# EAGLE design KW2CPU.PCB (EAGLE 6.6.0)
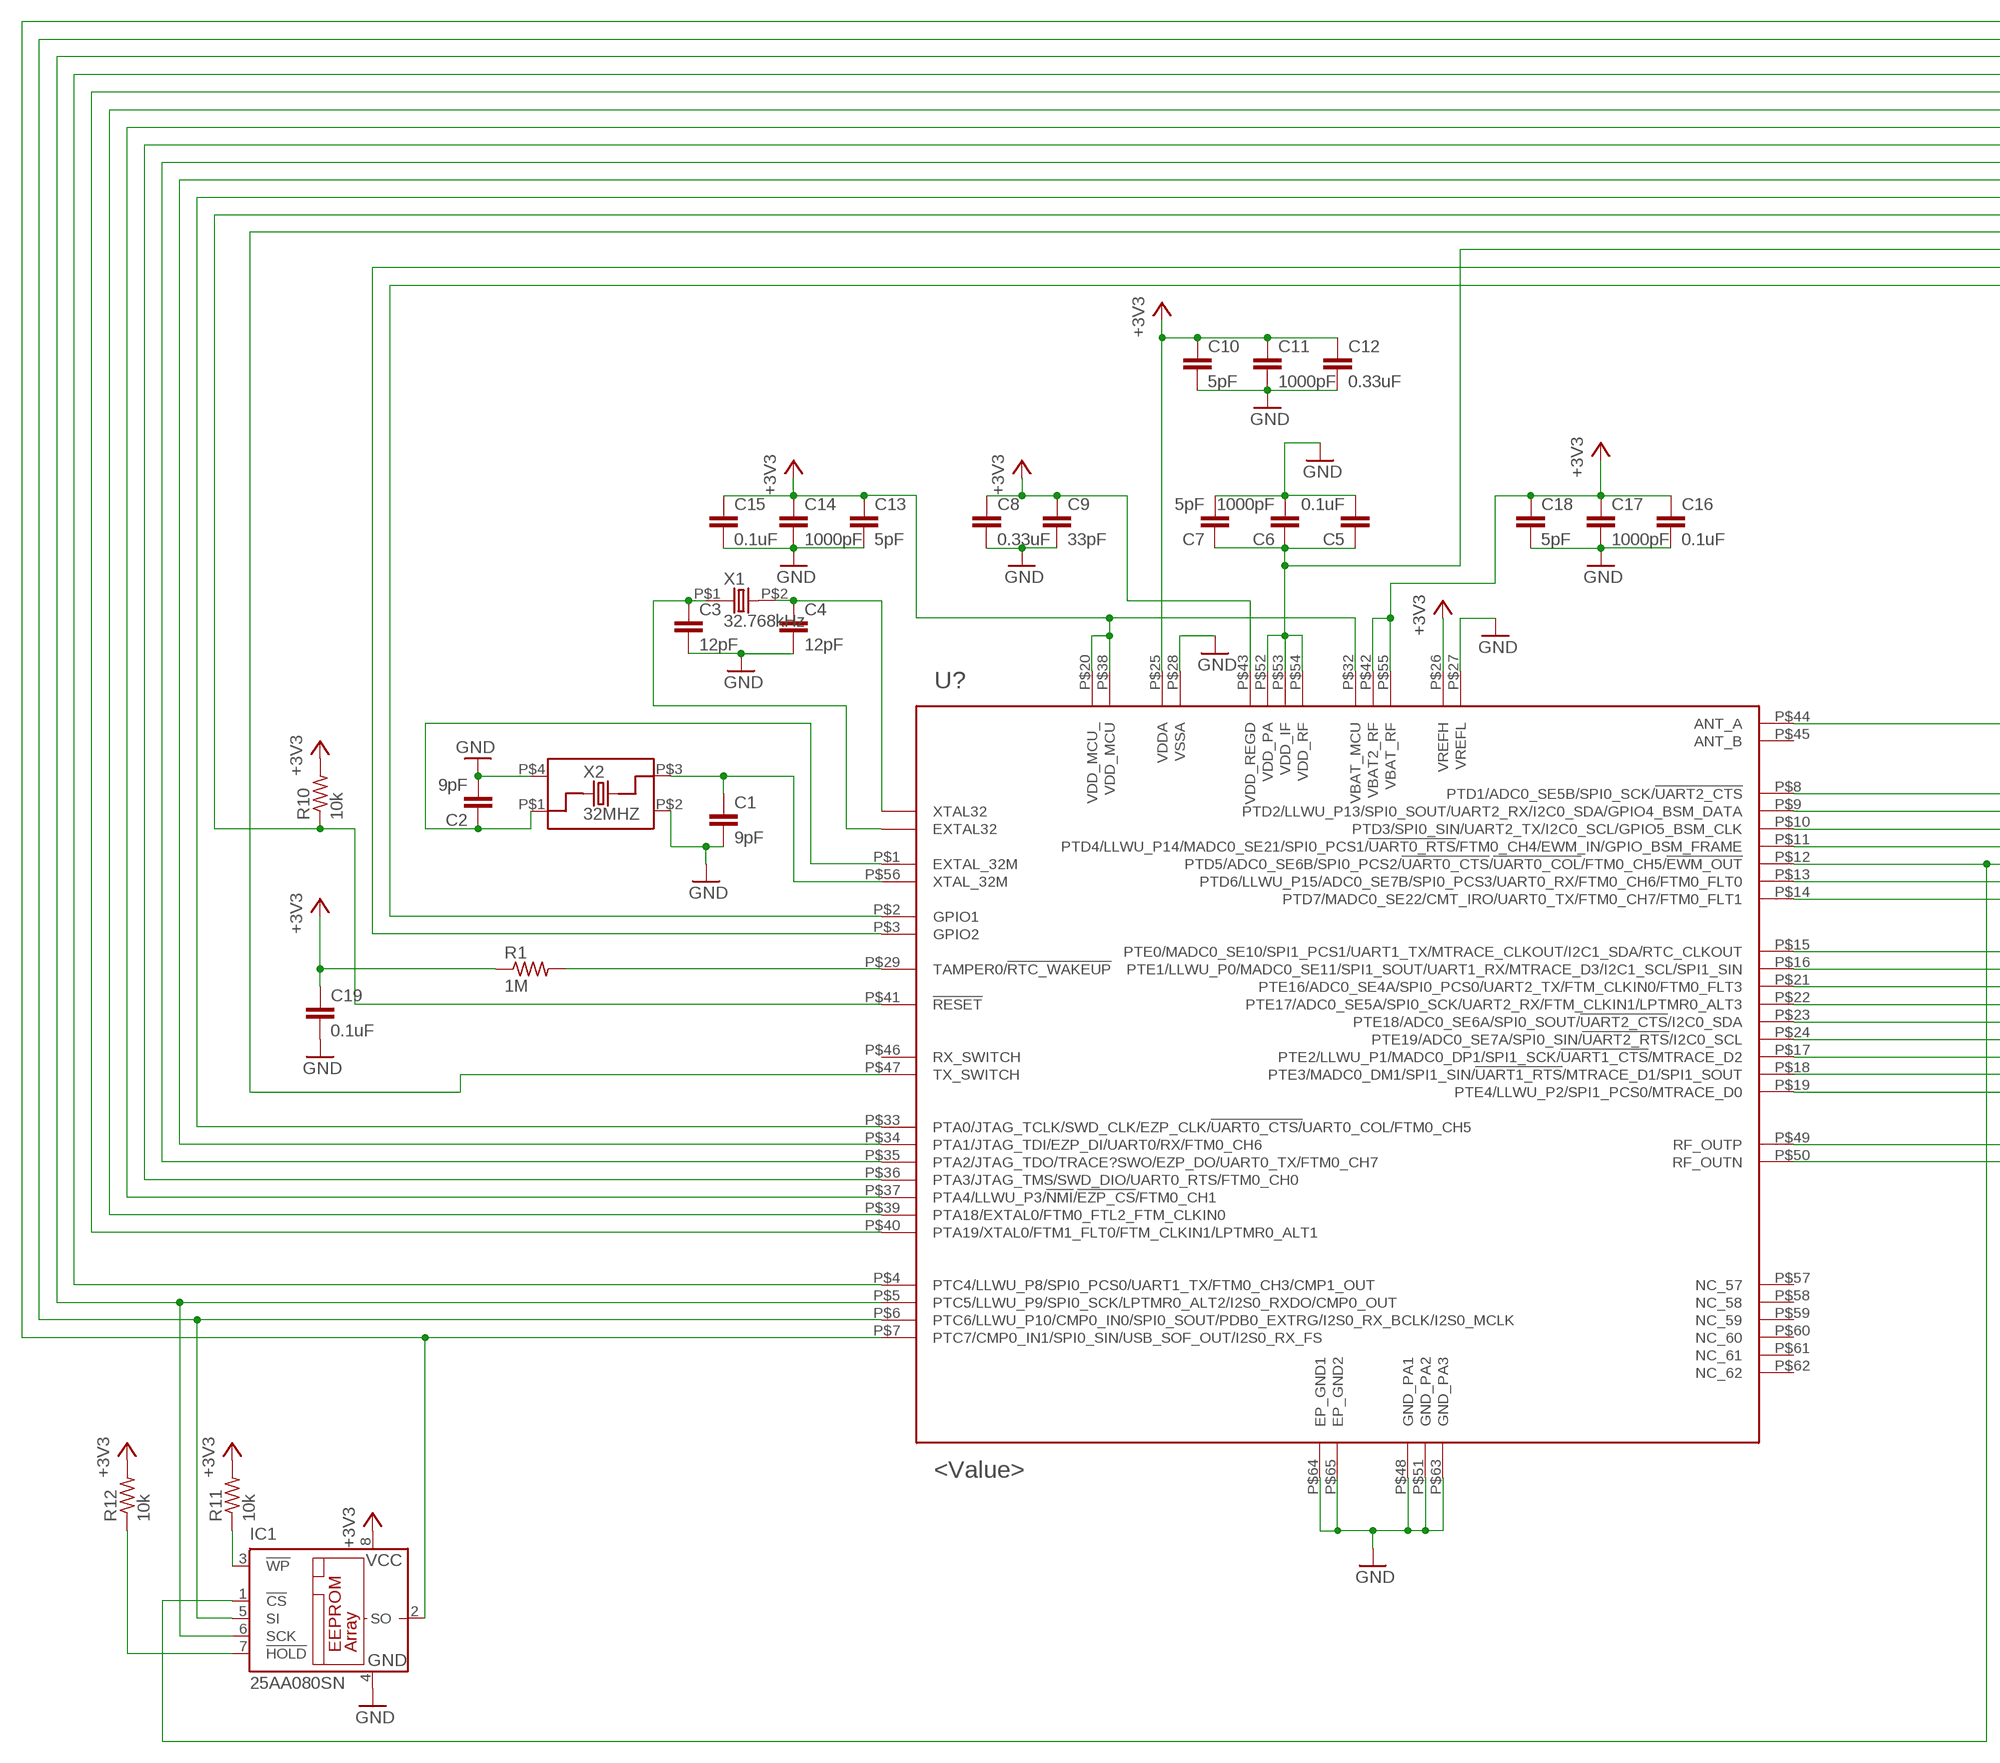
[diagram p0: schematic, sheet 1, part 1 of 2]
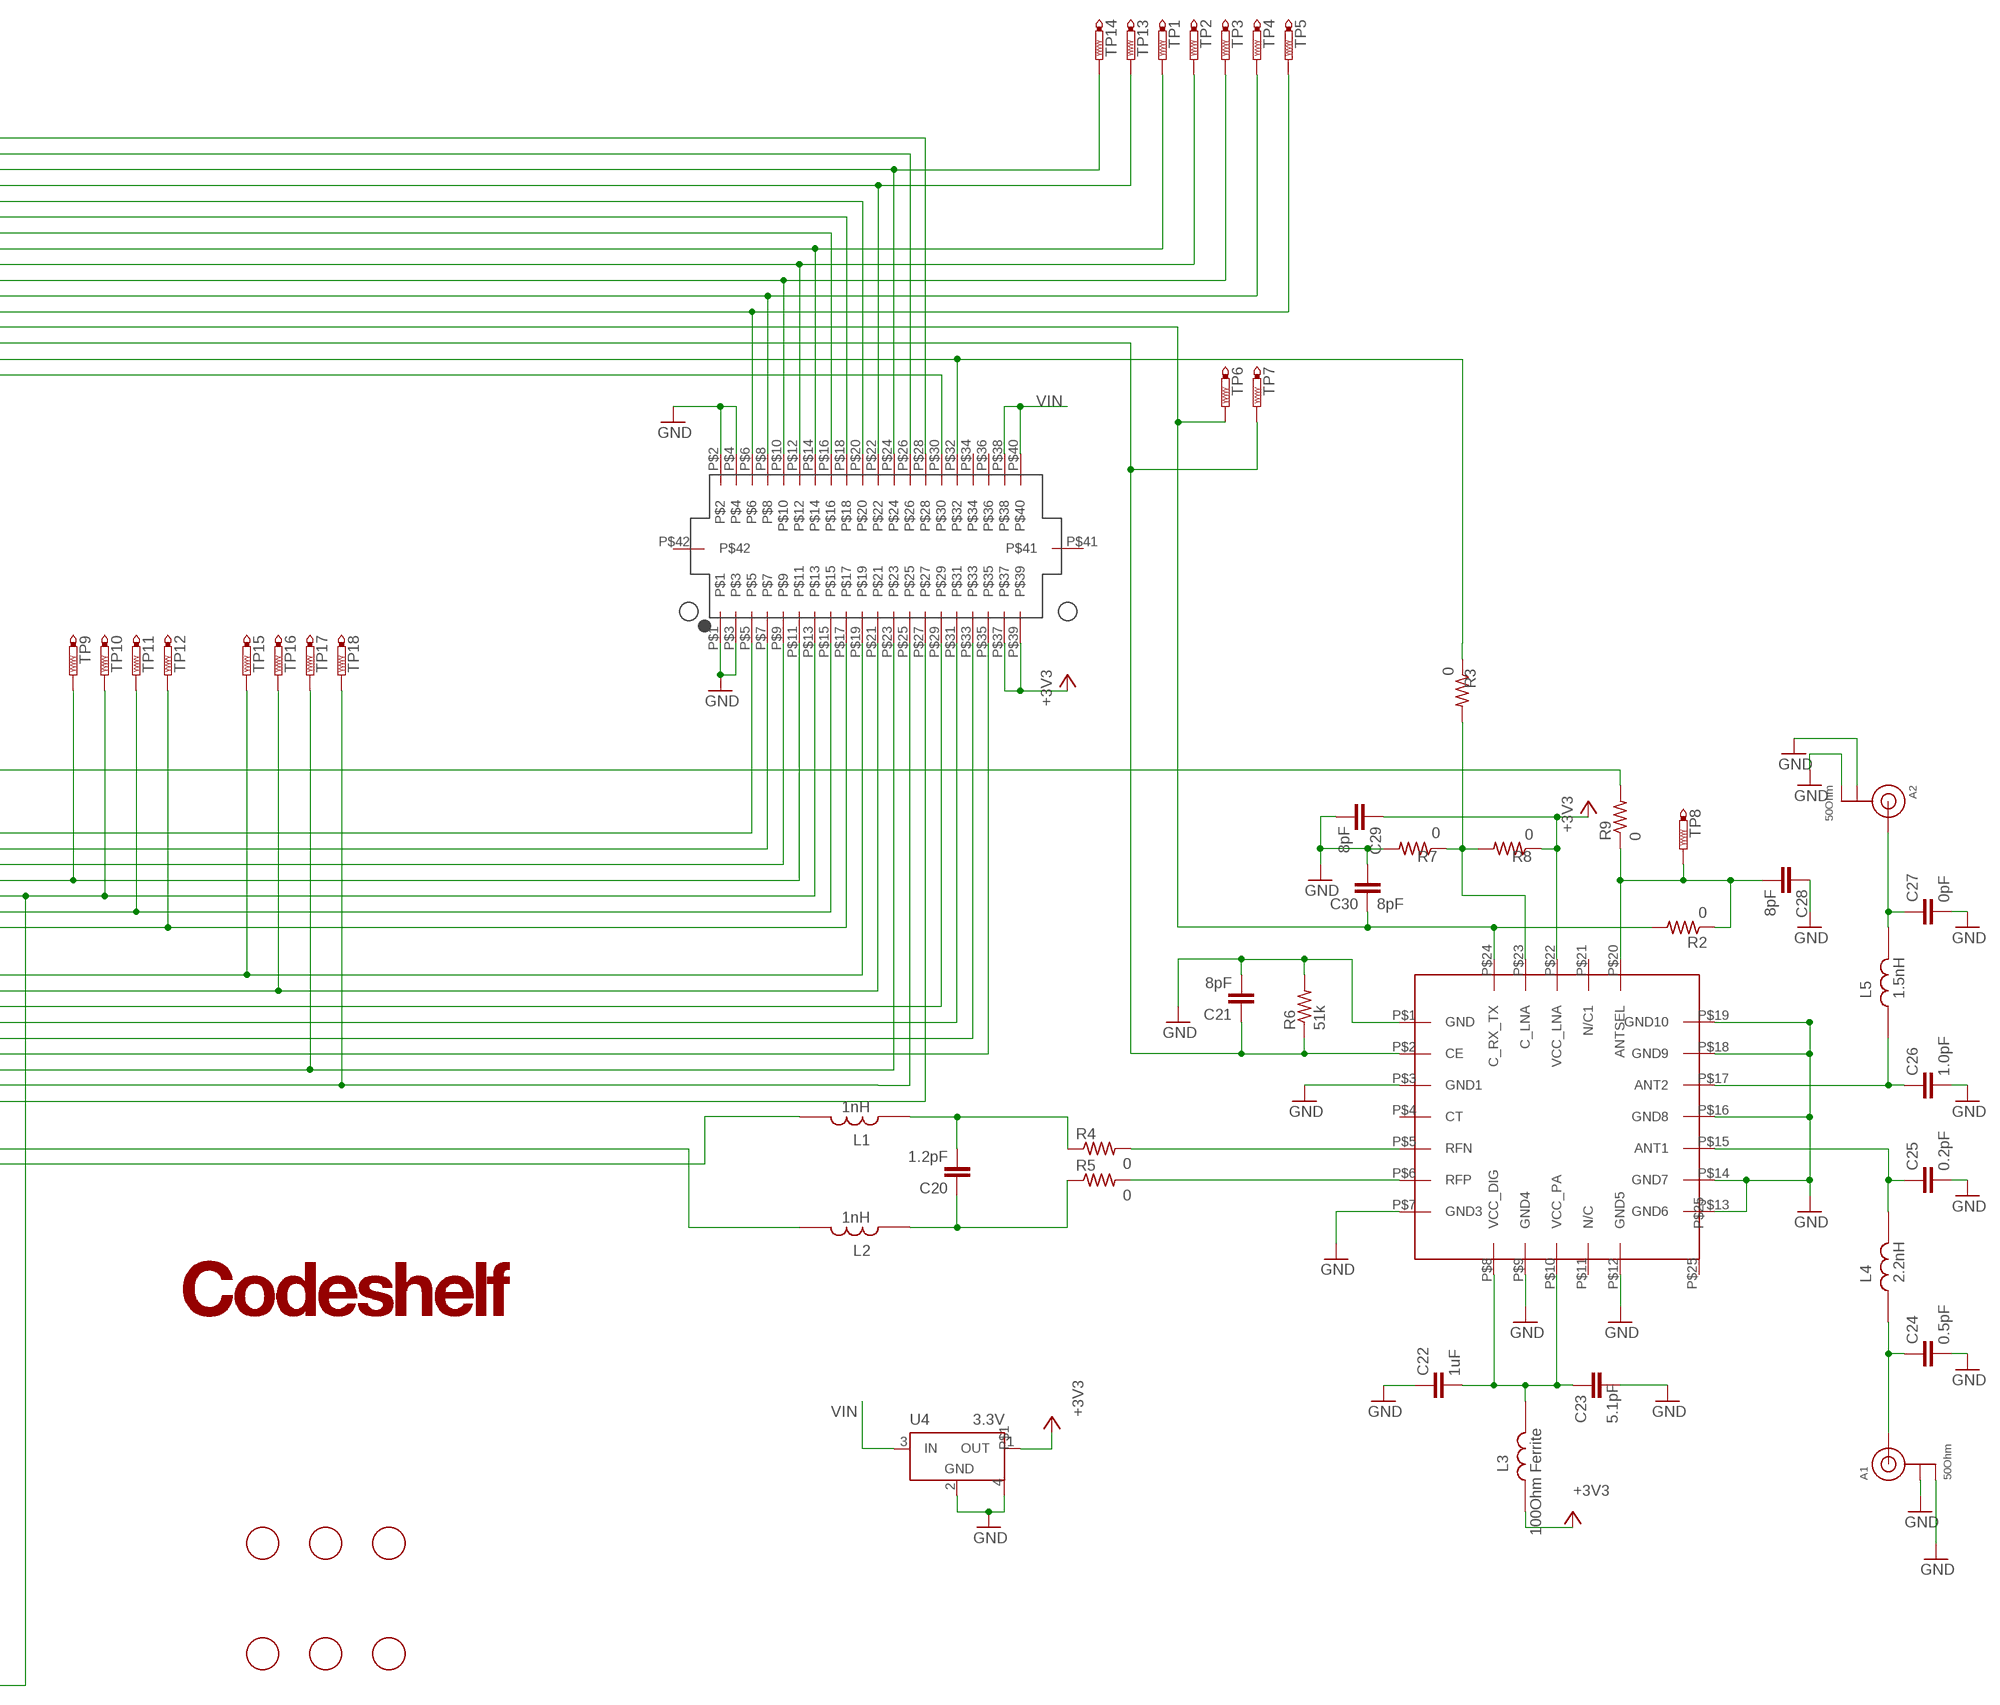
[diagram p1: schematic, sheet 1, part 2 of 2]

## Parts
A1  50Ohm  ANTENNA_U.FL  [U.FL]
A2  50Ohm  ANTENNA_U.FL  [U.FL]
C1  9pF  RF-C0402  [C0402]
C2  9pF  RF-C0402  [C0402]
C3  12pF  RF-C0402  [C0402]
C4  12pF  RF-C0402  [C0402]
C5  0.1uF  RF-C0402  [C0402]
C6  1000pF  RF-C0402  [C0402]
C7  5pF  RF-C0402  [C0402]
C8  0.33uF  RF-C0402  [C0402]
C9  33pF  RF-C0402  [C0402]
C10  5pF  RF-C0402  [C0402]
C11  1000pF  RF-C0402  [C0402]
C12  0.33uF  RF-C0402  [C0402]
C13  5pF  RF-C0402  [C0402]
C14  1000pF  RF-C0402  [C0402]
C15  0.1uF  RF-C0402  [C0402]
C16  0.1uF  RF-C0402  [C0402]
C17  1000pF  RF-C0402  [C0402]
C18  5pF  RF-C0402  [C0402]
C19  0.1uF  RF-C0402  [C0402]
C20  1.2pF  RF-C  [RF-L0201]
C21  8pF  RF-CRFMD  [RFMD0402]
C22  1uF  RF-C  [RF-L0201]
C23  5.1pF  RF-C  [RF-L0201]
C24  0.5pF  RF-CRFMD  [RFMD0402]
C25  0.2pF  RF-CRFMD  [RFMD0402]
C26  1.0pF  RF-CRFMD  [RFMD0402]
C27  0pF  RF-CRFMD  [RFMD0402]
C28  8pF  RF-CRFMD  [RFMD0402]
C29  8pF  RF-CRFMD  [RFMD0402]
C30  8pF  RF-CRFMD  [RFMD0402]
IC1  25AA080SN  [SO-08]
J1  DF12_M  [DF12_M]
L1  1nH  RF-L0201  [RF-L0201]
L2  1nH  RF-L0201  [RF-L0201]
L3  100Ohm Ferrite  RF-L  [RFMD0402]
L4  2.2nH  RF-L  [RFMD0402]
L5  1.5nH  RF-L  [RFMD0402]
R1  1M  RF-R0402  [RF-R0402]
R2  0  RF-RRFMD  [RFMD0402]
R3  0  RF-RRFMD  [RFMD0402]
R4  0  RF-R  [RF-L0201]
R5  0  RF-R  [RF-L0201]
R6  51k  RF-RRFMD  [RFMD0402]
R7  0  RF-RRFMD  [RFMD0402]
R8  0  RF-RRFMD  [RFMD0402]
R9  0  RF-RRFMD  [RFMD0402]
R10  10k  RF-R0402  [RF-R0402]
R11  10k  RF-R0402  [RF-R0402]
R12  10k  RF-R0402  [RF-R0402]
TP1  PTR1TP15R  [TP15R]
TP2  PTR1TP15R  [TP15R]
TP3  PTR1TP15R  [TP15R]
TP4  PTR1TP15R  [TP15R]
TP5  PTR1TP15R  [TP15R]
TP6  PTR1TP15R  [TP15R]
TP7  PTR1TP15R  [TP15R]
TP8  PTR1TP15R  [TP15R]
TP9  PTR1TP15R  [TP15R]
TP10  PTR1TP15R  [TP15R]
TP11  PTR1TP15R  [TP15R]
TP12  PTR1TP15R  [TP15R]
TP13  PTR1TP15R  [TP15R]
TP14  PTR1TP15R  [TP15R]
TP15  PTR1TP15R  [TP15R]
TP16  PTR1TP15R  [TP15R]
TP17  PTR1TP15R  [TP15R]
TP18  PTR1TP15R  [TP15R]
U1  MKW21D  [LGA63]
U3  RF6555  [RF6555]
U4  3.3V  MCP1804T-3302I  [SOT223]
U$1  CODESHELF-LOGOSMALL  [CODESHELF-LOGO-SMALL]
U$2  FIDUCIAL  [FIDUCIAL_1MM]
U$3  FIDUCIAL  [FIDUCIAL_1MM]
U$4  FIDUCIAL  [FIDUCIAL_1MM]
U$5  FIDUCIAL  [FIDUCIAL_1MM]
U$6  FIDUCIAL  [FIDUCIAL_1MM]
U$7  FIDUCIAL  [FIDUCIAL_1MM]
X1  32.768kHz  32KHZ  [32KHZSMD]
X2  32MHZ  [32MHZSMD]

## Nets
!HOLD: IC1.7(!HOLD) R12.1
!RESET: J1.P$6 R10.1 TP5.TP U1.P$41(!RESET)
!WP: IC1.3(!WP) R11.1
+3V3: C8.1 C9.1 C10.1 C11.1 C12.1 C13.1 C14.1 C15.1 C16.1 C17.1 C18.1 C19.1 C29.P$1 IC1.8(VCC) J1.P$37 J1.P$39 L3.P$2 R1.1 R8.P$1 R10.2 R11.2 R12.2 U1.P$20(VDD_MCU_) U1.P$25(VDDA) U1.P$26(VREFH) U1.P$32(VBAT_MCU) U1.P$38(VDD_MCU) U1.P$42(VBAT2_RF) U1.P$43(VDD_REGD) U1.P$55(VBAT_RF) U3.P$22(VCC_LNA) U4.1(OUT)
ANT1: C25.P$1 L4.P$1 U3.P$15(ANT1)
ANT2: C26.P$1 L5.P$2 U3.P$17(ANT2)
ANT_A: R9.P$2 U1.P$44(ANT_A)
ANTSEL: C28.P$2 R2.P$1 R9.P$1 TP8.TP U3.P$20(ANTSEL)
C_LNA: R3.P$2 R7.P$1 R8.P$2 U3.P$23(C_LNA)
EXTAL32: C3.1 U1.P$31(EXTAL32) X1.P$1
EXTAL_32M: C2.1 U1.P$1(EXTAL_32M) X2.P$1
GND: A1.1(GND) A1.2(GND) A2.1(GND) A2.2(GND) C1.2 C2.2 C3.2 C4.2 C5.2 C6.2 C7.2 C8.2 C9.2 C10.2 C11.2 C12.2 C13.2 C14.2 C15.2 C16.2 C17.2 C18.2 C19.2 C21.P$2 C22.P$1 C23.P$2 C24.P$2 C25.P$2 C26.P$2 C27.P$2 C28.P$1 C29.P$2 C30.P$1 IC1.4(GND) J1.P$1 J1.P$2 J1.P$3 J1.P$4 R6.P$2 R7.P$2 U1.P$27(VREFL) U1.P$28(VSSA) U1.P$48(GND_PA1) U1.P$51(GND_PA2) U1.P$63(GND_PA3) U1.P$64(EP_GND1) U1.P$65(EP_GND2) U3.P$1(GND) U3.P$3(GND1) U3.P$7(GND3) U3.P$9(GND4) U3.P$12(GND5) U3.P$13(GND6) U3.P$14(GND7) U3.P$16(GND8) U3.P$18(GND9) U3.P$19(GND10) U4.2(GND) U4.4 X2.P$2 X2.P$4
GPIO1: J1.P$30 U1.P$2(GPIO1)
GPIO2: J1.P$32 R3.P$1 U1.P$3(GPIO2)
PTA0/JTAG_TCLK/SWD_CLK/EZP_CLK/!UART0_CTS/!UART0_COL/FTM0_CH5: J1.P$8 TP4.TP U1.P$33(PTA0/JTAG_TCLK/SWD_CLK/EZP_CLK/!UART0_CTS/!UART0_COL/FTM0_CH5)
PTA1/JTAG_TDI/EZP_DI/UART0/RX/FTM0_CH6: J1.P$10 TP3.TP U1.P$34(PTA1/JTAG_TDI/EZP_DI/UART0/RX/FTM0_CH6)
PTA2/JTAG_TDO/TRACE?SWO/EZP_DO/UART0_TX/FTM0_CH7: J1.P$12 TP2.TP U1.P$35(PTA2/JTAG_TDO/TRACE?SWO/EZP_DO/UART0_TX/FTM0_CH7)
PTA3/JTAG_TMS/SWD_DIO/UART0_RTS/FTM0_CH0: J1.P$14 TP1.TP U1.P$36(PTA3/JTAG_TMS/SWD_DIO/UART0_RTS/FTM0_CH0)
PTA4/LLWU_P3/!NMI!/!EZP_CS!/FTM0_CH1: J1.P$16 U1.P$37(PTA4/LLWU_P3/!NMI!/!EZP_CS!/FTM0_CH1)
PTA18/EXTAL0/FTM0_FTL2_FTM_CLKIN0: J1.P$18 U1.P$39(PTA18/EXTAL0/FTM0_FTL2_FTM_CLKIN0)
PTA19/XTAL0/FTM1_FLT0/FTM_CLKIN1/LPTMR0_ALT1: J1.P$20 U1.P$40(PTA19/XTAL0/FTM1_FLT0/FTM_CLKIN1/LPTMR0_ALT1)
PTC4/LLWU_P8/SPI0_PCS0/UART1_TX/FTM0_CH3/CMP1_OUT: J1.P$22 TP13.TP U1.P$4(PTC4/LLWU_P8/SPI0_PCS0/UART1_TX/FTM0_CH3/CMP1_OUT)
PTC5/LLWU_P9/SPI0_SCK/LPTMR0_ALT2/I2S0_RXDO/CMP0_OUT: IC1.6(SCK) J1.P$24 TP14.TP U1.P$5(PTC5/LLWU_P9/SPI0_SCK/LPTMR0_ALT2/I2S0_RXDO/CMP0_OUT)
PTC6/LLWU_P10/CMP0_IN0/SPI0_SOUT/PDB0_EXTRG/I2S0_RX_BCLK/I2S0_MCLK: IC1.5(SI) J1.P$26 U1.P$6(PTC6/LLWU_P10/CMP0_IN0/SPI0_SOUT/PDB0_EXTRG/I2S0_RX_BCLK/I2S0_MCLK)
PTC7/CMP0_IN1/SPI0_SIN/USB_SOF_OUT/I2S0_RX_FS: IC1.2(SO) J1.P$28 U1.P$7(PTC7/CMP0_IN1/SPI0_SIN/USB_SOF_OUT/I2S0_RX_FS)
PTD1/ADC0_SE5B/SPI0_SCK/!UART2_CTS: J1.P$5 U1.P$8(PTD1/ADC0_SE5B/SPI0_SCK/!UART2_CTS)
PTD2/LLWU_P13/SPI0_SOUT/UART2_RX/I2C0_SDA/GPIO4_BSM_DATA: J1.P$7 U1.P$9(PTD2/LLWU_P13/SPI0_SOUT/UART2_RX/I2C0_SDA/GPIO4_BSM_DATA)
PTD3/SPI0_SIN/UART2_TX/I2C0_SCL/GPIO5_BSM_CLK: J1.P$9 U1.P$10(PTD3/SPI0_SIN/UART2_TX/I2C0_SCL/GPIO5_BSM_CLK)
PTD4/LLWU_P14/MADC0_SE21/SPI0_PCS1/!UART0_RTS!/FTM0_CH4/EWM_IN/GPIO_BSM_FRAME: J1.P$11 TP9.TP U1.P$11(PTD4/LLWU_P14/MADC0_SE21/SPI0_PCS1/!UART0_RTS!/FTM0_CH4/EWM_IN/GPIO_BSM_FRAME)
PTD5/ADC0_SE6B/SPI0_PCS2/!UART0_CTS!/!UART0_COL!/FTM0_CH5/!EWM_OUT: IC1.1(!CS) J1.P$13 TP10.TP U1.P$12(PTD5/ADC0_SE6B/SPI0_PCS2/!UART0_CTS!/!UART0_COL!/FTM0_CH5/!EWM_OUT)
PTD6/LLWU_P15/ADC0_SE7B/SPI0_PCS3/UART0_RX/FTM0_CH6/FTM0_FLT0: J1.P$15 TP11.TP U1.P$13(PTD6/LLWU_P15/ADC0_SE7B/SPI0_PCS3/UART0_RX/FTM0_CH6/FTM0_FLT0)
PTD7/MADC0_SE22/CMT_IRO/UART0_TX/FTM0_CH7/FTM0_FLT1: J1.P$17 TP12.TP U1.P$14(PTD7/MADC0_SE22/CMT_IRO/UART0_TX/FTM0_CH7/FTM0_FLT1)
PTE0/MADC0_SE10/SPI1_PCS1/UART1_TX/MTRACE_CLKOUT/I2C1_SDA/RTC_CLKOUT: J1.P$19 TP15.TP U1.P$15(PTE0/MADC0_SE10/SPI1_PCS1/UART1_TX/MTRACE_CLKOUT/I2C1_SDA/RTC_CLKOUT)
PTE1/LLWU_P0/MADC0_SE11/SPI1_SOUT/UART1_RX/MTRACE_D3/I2C1_SCL/SPI1_SIN: J1.P$21 TP16.TP U1.P$16(PTE1/LLWU_P0/MADC0_SE11/SPI1_SOUT/UART1_RX/MTRACE_D3/I2C1_SCL/SPI1_SIN)
PTE2/LLWU_P1/MADC0_DP1/SPI1_SCK/!UART1_CTS!/MTRACE_D2: J1.P$23 TP17.TP U1.P$17(PTE2/LLWU_P1/MADC0_DP1/SPI1_SCK/!UART1_CTS!/MTRACE_D2)
PTE3/MADC0_DM1/SPI1_SIN/!UART1_RTS!/MTRACE_D1/SPI1_SOUT: J1.P$25 TP18.TP U1.P$18(PTE3/MADC0_DM1/SPI1_SIN/!UART1_RTS!/MTRACE_D1/SPI1_SOUT)
PTE4/LLWU_P2/SPI1_PCS0/MTRACE_D0: J1.P$27 U1.P$19(PTE4/LLWU_P2/SPI1_PCS0/MTRACE_D0)
PTE16/ADC0_SE4A/SPI0_PCS0/UART2_TX/FTM_CLKIN0/FTM0_FLT3: J1.P$29 U1.P$21(PTE16/ADC0_SE4A/SPI0_PCS0/UART2_TX/FTM_CLKIN0/FTM0_FLT3)
PTE17/ADC0_SE5A/SPI0_SCK/UART2_RX/FTM_CLKIN1/LPTMR0_ALT3: J1.P$31 U1.P$22(PTE17/ADC0_SE5A/SPI0_SCK/UART2_RX/FTM_CLKIN1/LPTMR0_ALT3)
PTE18/ADC0_SE6A/SPI0_SOUT/!UART2_CTS!/I2C0_SDA: J1.P$33 U1.P$23(PTE18/ADC0_SE6A/SPI0_SOUT/!UART2_CTS!/I2C0_SDA)
PTE19/ADC0_SE7A/SPI0_SIN/!UART2_RTS!/I2C0_SCL: J1.P$35 U1.P$24(PTE19/ADC0_SE7A/SPI0_SIN/!UART2_RTS!/I2C0_SCL)
RADIO_AREG: C5.1 C6.1 C7.1 C21.P$1 R6.P$1 TP7.TP U1.P$52(VDD_PA) U1.P$53(VDD_IF) U1.P$54(VDD_RF) U3.P$2(CE)
RF_OUTN: L1.P$1 U1.P$50(RF_OUTN)
RF_OUTP: L2.P$1 U1.P$49(RF_OUTP)
RFN: R4.P$2 U3.P$5(RFN)
RFN_MATCH: C20.P$2 L1.P$2 R4.P$1
RFP: R5.P$2 U3.P$6(RFP)
RFP_MATCH: C20.P$1 L2.P$2 R5.P$1
TAMPER/!RTC_WAKEUP: R1.2 U1.P$29(TAMPER0/!RTC_WAKEUP)
TX_SWITCH: C30.P$2 R2.P$2 TP6.TP U1.P$47(TX_SWITCH) U3.P$24(C_RX_TX)
U.FL.ANT1: A1.3(SIGNAL) C24.P$1 L4.P$2
U.FL.ANT2: A2.3(SIGNAL) C27.P$1 L5.P$1
VCC_DIG_PA: C22.P$2 C23.P$1 L3.P$1 U3.P$8(VCC_DIG) U3.P$10(VCC_PA)
VIN: J1.P$38 J1.P$40 U4.3(IN)
XTAL32: C4.1 U1.P$30(XTAL32) X1.P$2
XTAL_32M: C1.1 U1.P$56(XTAL_32M) X2.P$3
Unconnected: J1.P$34 J1.P$36 J1.P$41 J1.P$42 U1.P$45(ANT_B) U1.P$46(RX_SWITCH) U1.P$57(NC_57) U1.P$58(NC_58) U1.P$59(NC_59) U1.P$60(NC_60) U1.P$61(NC_61) U1.P$62(NC_62) U3.P$4(CT) U3.P$11(N/C) U3.P$21(N/C1) U3.P$25

## Library data of the parts
A1 A2 = adafruit:ANTENNA_U.FL: U.FL Antenna Connector; MFGN: Hirose; MFGP: N.FL-R-SMT-1(10)
C1 C2 = GW-devices:RF-C: RF capacitor pads for FSL reference design; MFGN: Murata; MFGP: GRM1555C1H9R0DA01D
C3 C4 = GW-devices:RF-C: RF capacitor pads for FSL reference design; MFGN: Murata; MFGP: GRM1555C1H120JA01D
C5 C15 C16 C19 = GW-devices:RF-C: RF capacitor pads for FSL reference design; MFGN: Murata; MFGP: GRM155R71C104KA88D
C6 C11 C14 C17 = GW-devices:RF-C: RF capacitor pads for FSL reference design; MFGN: Murata; MFGP: GRM155R71H102KA01D
C7 C10 C13 C18 = GW-devices:RF-C: RF capacitor pads for FSL reference design; MFGN: Murata; MFGP: GRM1555C1H5R0BA01D
C8 C12 = GW-devices:RF-C: RF capacitor pads for FSL reference design; MFGN: Murata; MFGP: GRM155R61A334KE15D
C9 = GW-devices:RF-C: RF capacitor pads for FSL reference design; MFGN: Murata; MFGP: GRM1555C1H330JA01D
C20 = GW-devices:RF-C: RF capacitor pads for FSL reference design; MFGN: TDK; MFGP: C0603C0G1E1R2B030BF
C21 C28-C30 = GW-devices:RF-C: RF capacitor pads for FSL reference design; MFGN: Murata; MFGP: GJM1555C1H8R0CB01D
C22 = GW-devices:RF-C: RF capacitor pads for FSL reference design; MFGN: TDK; MFGP: C0603X5R0J105M030BC
C23 = GW-devices:RF-C: RF capacitor pads for FSL reference design; MFGN: TDK; MFGP: C0603C0G1E5R1C030BG
C24-C27 = GW-devices:RF-C: RF capacitor pads for FSL reference design; NOTES: DNP
IC1 = microchip:25*: Serial EEPROM 4K/ 8K , SPI bus; MF: MICROCHIP; MFGN: Microchip; MFGP: 25AA640A-I/SN; MPN: 25AA640A
J1 = KW2:DF12_M: Hirose DF12 Male Connector; MFGN: Hirose; MFGP: DF12(3.0)-40DS-0.5V(86)
L1 L2 = GW-devices:RF-L: RF inductor pads for FSL reference design; MFGN: Murata; MFGP: LQP03TN1N0B02
L3 = GW-devices:RF-L: RF inductor pads for FSL reference design; MFGN: Murata; MFGP: BLM15AG100SN1D
L4 L5 = GW-devices:RF-L: RF inductor pads for FSL reference design; NOTES: DNP
R1 = GW-devices:RF-R: RF resistor pads for FSL reference design; MFGN: Panasonic; MFGP: ERJ-2GEJ105X
R2 R3 = GW-devices:RF-R: RF resistor pads for FSL reference design; MFGN: Panasonic; MFGP: ERJ-2GE0R00X
R4 R5 = GW-devices:RF-R: RF resistor pads for FSL reference design; MFGN: Panasonic; MFGP: ERJ-1GN0R00C
R6 = GW-devices:RF-R: RF resistor pads for FSL reference design; MFGN: Panasonic; MFGP: ERJ-2GEJ513X
R7-R9 = GW-devices:RF-R: RF resistor pads for FSL reference design; NOTES: DNP
R10-R12 = GW-devices:RF-R: RF resistor pads for FSL reference design; MFGN: Panasonic; MFGP: ERJ-2RKF1002X
TP1-TP18 = testpad:PTR1: TEST PIN; NOTES: DNP
U1 = ZIGBEE:MKW21D: Freescale's new Kinetis KW20 wireless MCUs expands on the successful Kinetis MCU family based on the ARM® Cortex-M4 CPU core. The Kinetis KW20 Wireless MCU integrates a class-leading RF transceiver, Cortex-M4 and a robust feature set for reliable, secure, and low-power IEEE® 802.15.4 wireless solutions. Product Summary Page: http://www.freescale.com/webapp/sps/site/prod_summary.jsp?code=KW20 Datasheet: http://cache.freescale.com/files/rf_if/doc/data_sheet/MKW22D512V.pdf; MFGN: Freescale; MFGP: MKW21D256VHA5
U3 = KW2:RF6555: RF Front End (PA / LNA); MFGN: RFMD; MFGP: RF6555
U4 = microchip:MCP1804T-3302I: VOLTAGE REGULATOR; MPN: MCP1804T-3302I; NOTES: DNP
U$1 = GW-devices:CODESHELF-LOGO
U$2-U$7 = adafruit:FIDUCIAL: For use by pick and place machines to calibrate the vision/machine, 1mm By microbuilder.eu; NOTES: DNP
X1 = KW2:32KHZ: 32Khz Crystal; MFGN: EPSON; MFGP: FC-135 32.7680KA-A3
X2 = KW2:32MHZ: 32Mhz crystal for KW2 radio; MFGN: NDK; MFGP: EXS00A-CS02368

## Board
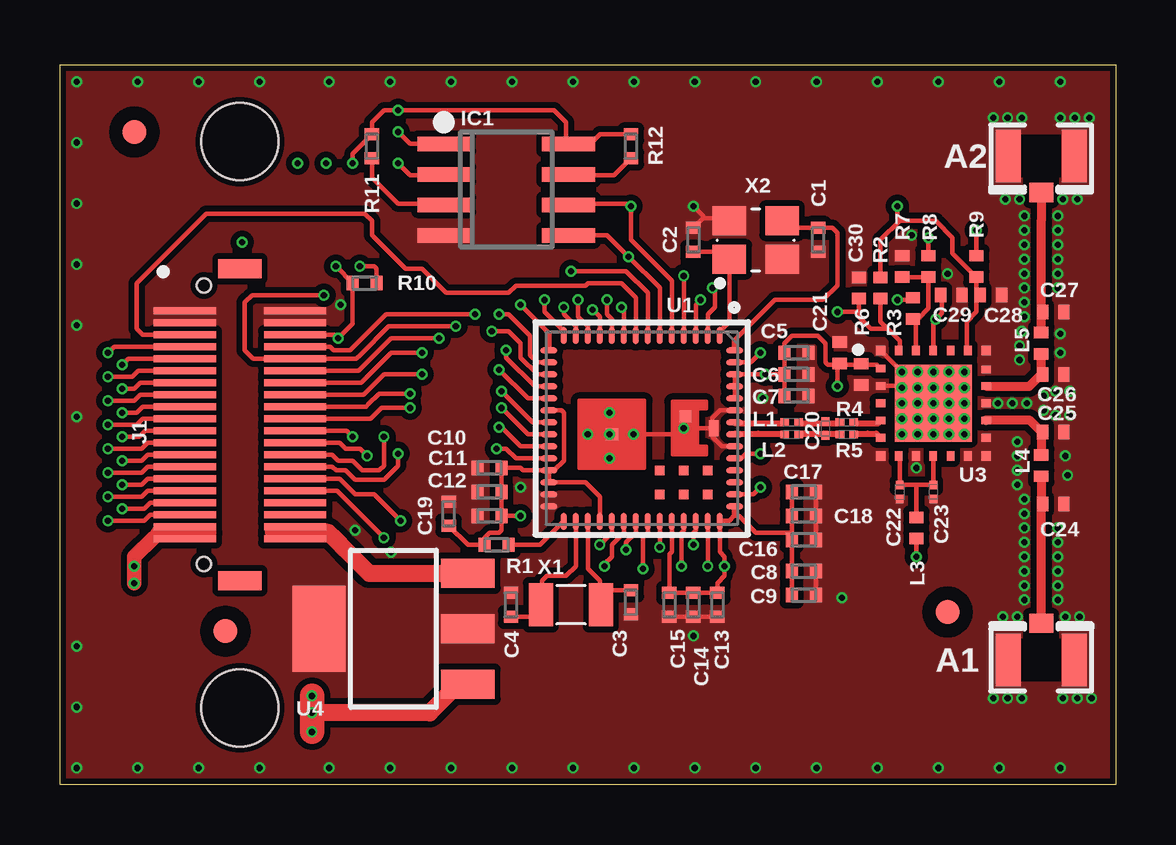
[diagram p2: board, top side]
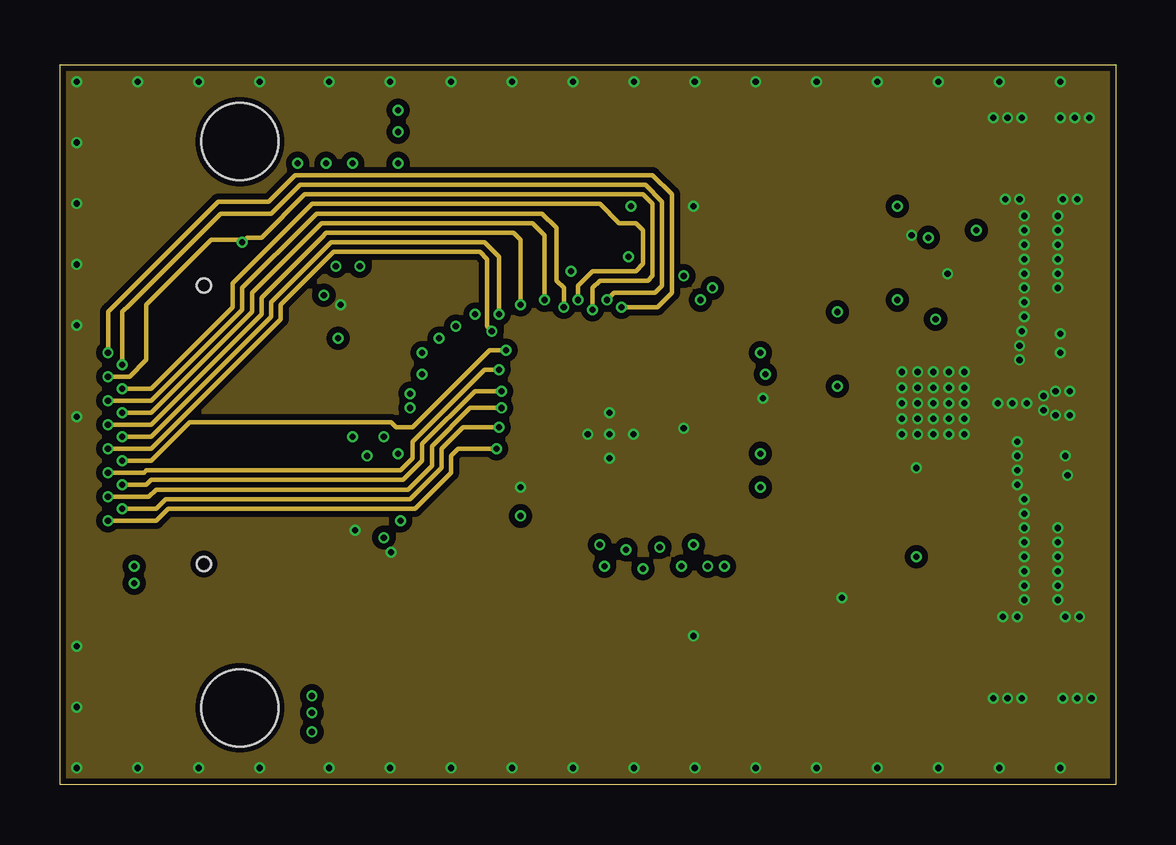
[diagram p3: board, inner layer Route2]
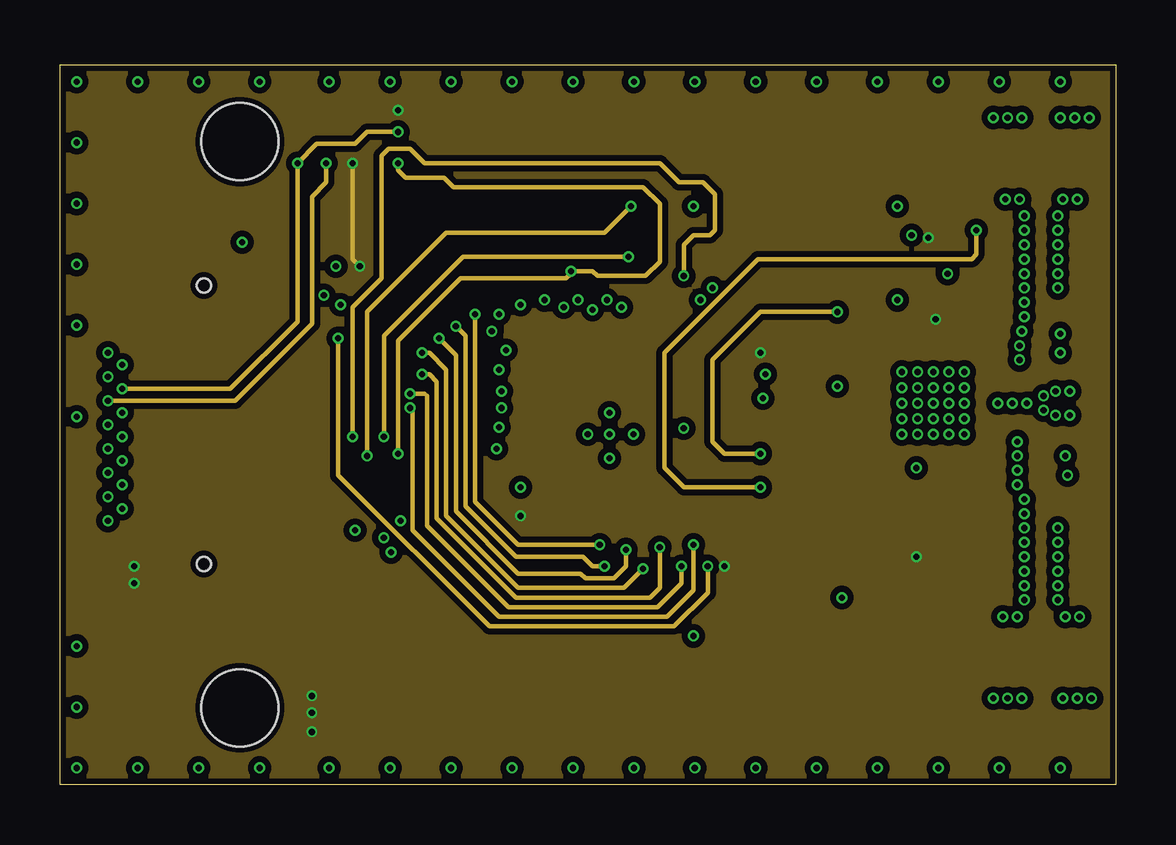
[diagram p4: board, inner layer Route15]
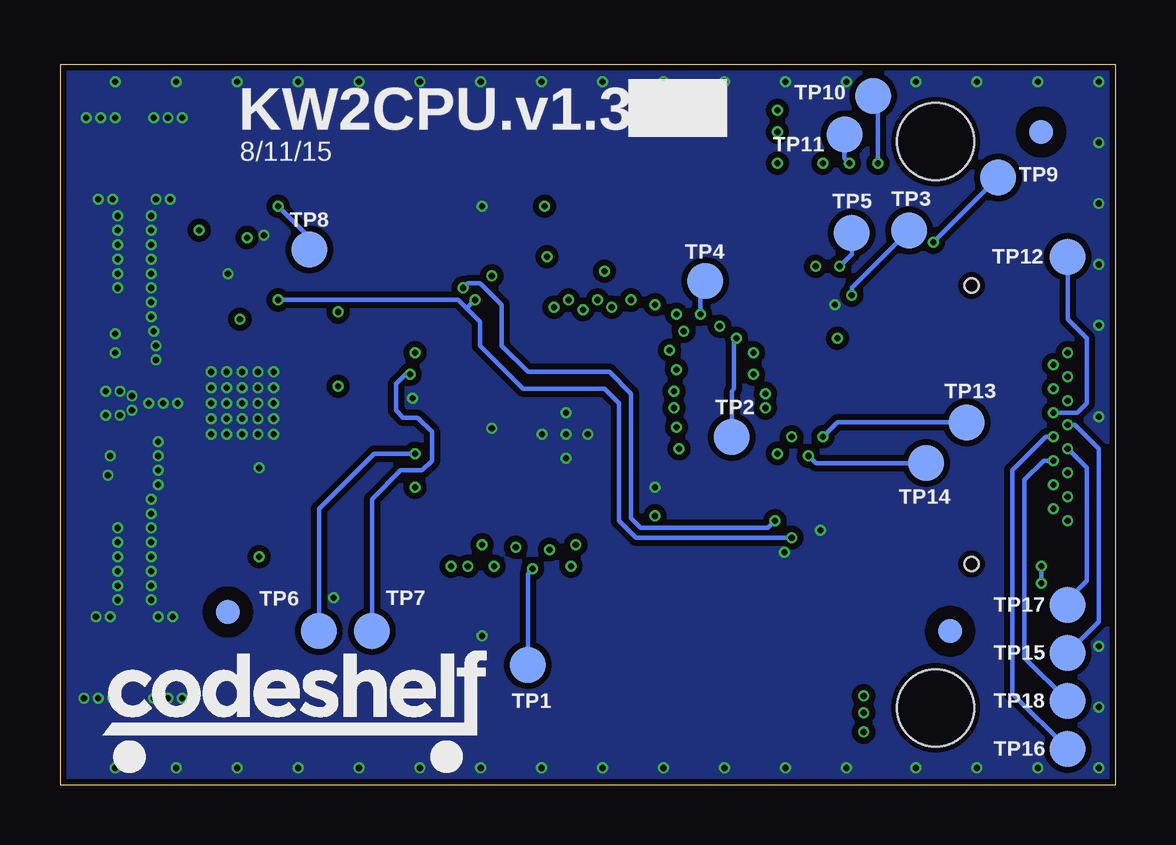
[diagram p5: board, bottom side, seen from below]

Size 44 x 30 mm. Coordinates in mm from the lower left corner, seen from the top.
Outline: 0,30 44,30 44,0 0,0 0,30
Copper layers (1*2*15*16): Top 0.035559375mm / dielectric 10mil / Route2 0.035559375mm / dielectric 38mil / Route15 0.035559375mm / dielectric 10mil / Bottom 0.035559375mm
Design rules "Innerstep *": minimum track width 5mil, minimum drill 4mil, track to track 10mil, track to pad 5mil, pad to pad 5mil, via to via 5mil, smd to smd 0mil, copper to edge 10mil, drill to drill 8mil, minimum pad ring 10mil, minimum via ring 4mil, stop-mask expansion 0mil, vias tented up to drill 20mil, thermal gap 10mil
Holes 3.2 mm at 7.5,3.2 7.5,26.8

### Footprints (pad centres in the part's own frame; a part is rotated, then mirrored left to right if it is on the bottom)
U.FL = smd 2.2 x 1.05: 1 0,1.375; 2 0,-1.375 | smd 0.8 x 1: 3 1.525,0
C0402 = smd 0.5 x 0.6: 1 -0.5,0; 2 0.5,0
RF-L0201 = smd 0.33 x 0.356: P$1 0,-0.29; P$2 0,0.29
RFMD0402 = smd 0.475 x 0.6: P$1 -0.445,0; P$2 0.445,0
SO-08 = smd 0.6 x 2.2: 1 -1.905,-2.6; 2 -0.635,-2.6; 3 0.635,-2.6; 4 1.905,-2.6; 5 1.905,2.6; 6 0.635,2.6; 7 -0.635,2.6; 8 -1.905,2.6
DF12_M = smd 0.3 x 2.6: P$1 4.75,2.3; P$2 4.75,-2.3; P$3 4.25,2.3; P$4 4.25,-2.3; P$5 3.75,2.3; P$6 3.75,-2.3; P$7 3.25,2.3; P$8 3.25,-2.3; P$9 2.75,2.3; P$10 2.75,-2.3; P$11 2.25,2.3; P$12 2.25,-2.3; P$13 1.75,2.3; P$14 1.75,-2.3; P$15 1.25,2.3; P$16 1.25,-2.3; P$17 0.75,2.3; P$18 0.75,-2.3; P$19 0.25,2.3; P$20 0.25,-2.3; P$21 -0.25,2.3; P$22 -0.25,-2.3; P$23 -0.75,2.3; P$24 -0.75,-2.3; P$25 -1.25,2.3; P$26 -1.25,-2.3; P$27 -1.75,2.3; P$28 -1.75,-2.3; P$29 -2.25,2.3; P$30 -2.25,-2.3; P$31 -2.75,2.3; P$32 -2.75,-2.3; P$33 -3.25,2.3; P$34 -3.25,-2.3; P$35 -3.75,2.3; P$36 -3.75,-2.3; P$37 -4.25,2.3; P$38 -4.25,-2.3; P$39 -4.75,2.3; P$40 -4.75,-2.3 | smd 0.8 x 1.8: P$41 -6.5,0; P$42 6.5,0 | hole 0.6: -5.8,1.5; 5.8,1.5
RF-R0402 = smd 0.5 x 0.6: 1 -0.5,0; 2 0.5,0
TP15R = smd 1.5 x 1.5: TP 0,0
LGA63 = smd 0.711 x 0.254: P$1 0.125,7.25; P$2 0.125,6.75; P$3 0.125,6.25; P$4 0.125,5.75; P$5 0.125,5.25; P$6 0.125,4.75; P$7 0.135,4.25; P$8 0.135,3.75; P$9 0.125,3.25; P$10 0.125,2.75; P$11 0.125,2.25; P$12 0.125,1.75; P$13 0.125,1.25; P$14 0.125,0.75; P$29 7.875,0.75; P$30 7.875,1.25; P$31 7.875,1.75; P$32 7.875,2.25; P$33 7.875,2.75; P$34 7.875,3.25; P$35 7.885,3.75; P$36 7.885,4.25; P$37 7.875,4.75; P$38 7.875,5.25; P$39 7.875,5.75; P$40 7.875,6.25; P$41 7.875,6.75; P$42 7.875,7.25 | smd 0.254 x 0.711: P$15 0.75,0.125; P$16 1.25,0.125; P$17 1.75,0.125; P$18 2.25,0.125; P$19 2.75,0.125; P$20 3.25,0.125; P$21 3.75,0.135; P$22 4.25,0.135; P$23 4.75,0.125; P$24 5.25,0.125; P$25 5.75,0.125; P$26 6.25,0.125; P$27 6.75,0.125; P$28 7.25,0.125; P$43 7.25,7.875; P$44 6.75,7.875; P$45 6.25,7.875; P$46 5.75,7.875; P$47 5.25,7.874; P$48 4.751,7.874; P$49 4.25,7.874; P$50 3.75,7.875; P$51 3.25,7.875; P$52 2.75,7.875; P$53 2.25,7.875; P$54 1.75,7.875; P$55 1.25,7.875; P$56 0.75,7.875 | smd 0.406 x 0.406: P$57 5.75,6.75; P$58 6.75,6.75; P$59 5.75,5.75; P$60 6.75,5.75; P$61 5.75,4.75; P$62 6.75,4.75 | smd 0.66 x 0.406: P$63 4,7 | smd 0.5 x 0.5: P$64 3.5,5.812; P$65 4.25,2.75
RF6555 = smd 0.4 x 0.4: P$1 -2.2,2.2; P$7 -2.2,-2.2; P$13 2.2,-2.2; P$19 2.2,2.2 | smd 0.4 x 0.32: P$2 -2.2,1.44; P$3 -2.2,0.72; P$4 -2.2,0; P$5 -2.2,-0.72; P$6 -2.2,-1.44; P$14 2.2,-1.44; P$15 2.2,-0.72; P$16 2.2,0; P$17 2.2,0.72; P$18 2.2,1.4 | smd 0.32 x 0.4: P$8 -1.44,-2.2; P$9 -0.72,-2.2; P$10 0,-2.2; P$11 0.72,-2.2; P$12 1.44,-2.2; P$20 1.44,2.2; P$21 0.72,2.2; P$22 0,2.2; P$23 -0.72,2.2; P$24 -1.44,2.2 | smd 3.2 x 3.2: P$25 0,0
SOT223 = smd 1.219 x 2.235: 1 -2.311,-3.099; 2 0,-3.099; 3 2.311,-3.099 | smd 3.6 x 2.2: 4 0,3.099
FIDUCIAL_1MM = smd 1 x 1: 1 0,0
32KHZSMD = smd 1 x 1.8: P$1 1.25,0; P$2 -1.25,0
32MHZSMD = smd 1.4 x 1.2: P$1 -1.1,-0.8; P$2 1.1,-0.8; P$3 1.1,0.8; P$4 -1.1,0.8

### Placement (x,y rotation side)
A1  40.9,5.2 90 top
A2  40.9,26.2 270 top
C1  31.6,22.7 270 top
C2  26.4,22.7 90 top
C3  23.8,7.6 270 top
C4  18.8,7.5 90 top
C5  30.7,18 0 top
C6  30.7,17.1 0 top
C7  30.7,16.2 0 top
C8  31,8.9 0 top
C9  31,7.9 0 top
C10  17.9,13.2 180 top
C11  17.9,12.2 180 top
C12  17.9,11.2 180 top
C13  27.4,7.5 270 top
C14  26.4,7.5 270 top
C15  25.4,7.5 270 top
C16  31,10.2 0 top
C17  31,12.2 0 top
C18  31,11.2 0 top
C19  16.2,11.3 90 top
C20  31.9,14.85 0 top
C21  32.5,18 90 top
C22  35,12.2 0 top
C23  36.4,12.2 180 top
C24  41.4,11.7 0 top
C25  41.4,14.7 0 top
C26  41.4,17.1 0 top
C27  41.4,19.7 0 top
C28  38.8,20.4 180 top
C29  37.15,20.4 0 top
C30  33.3,20.7 270 top
IC1  18.6,24.8 270 top
J1  7.5,15 90 top
L1  30.5,15.1 270 top
L2  30.5,14.59 270 top
L3  35.7,10.7 270 top
L4  40.9,13.3 270 top
L5  40.9,18.4 270 top
R1  18.2,10 0 top
R2  34.2,20.7 270 top
R3  35.55,19.85 270 top
R4  32.8,15.1 270 top
R5  32.8,14.59 270 top
R6  33.4,17.1 270 top
R7  35.1,21.6 90 top
R8  36.2,21.6 270 top
R9  38.2,21.6 90 top
R10  12.7,20.9 0 top
R11  13,26.6 90 top
R12  23.8,26.6 90 top
TP1  24.5,5 0 bottom
TP2  16,14.5 0 bottom
TP3  8.6,23.1 0 bottom
TP4  17.1,21 0 bottom
TP5  11,23 0 bottom
TP6  33.2,6.4 0 bottom
TP7  31,6.4 0 bottom
TP8  33.6,22.3 0 bottom
TP9  4.9,25.3 0 bottom
TP10  10.1,28.7 0 bottom
TP11  11.3,27.1 0 bottom
TP12  2,22 0 bottom
TP13  6.2,15.1 0 bottom
TP14  7.9,13.4 0 bottom
TP15  2,5.5 0 bottom
TP16  2,1.5 0 bottom
TP17  2,7.5 0 bottom
TP18  2,3.5 0 bottom
U1  20.25,18.85 270 top
U3  36.4,15.9 0 top
U4  13.9,6.5 90 top
U$1  42.3,0.4 0 bottom
U$2  3.1,27.2 0 bottom
U$3  6.9,6.4 0 bottom
U$4  37,7.2 0 bottom
U$5  6.9,6.4 0 top
U$6  37,7.2 0 top
U$7  3.1,27.2 0 top
X1  21.3,7.5 0 top
X2  29,22.7 0 top

### Tracks (layer width: path | path; a pad name or v marks a point on that pad's centre or on a via)
!HOLD
  Top 0.178: R12.1 23.6,25.9 23.1,25.4 21.23,25.4 IC1.7
!RESET  (via drill 0.25)
  Top 0.178: U1.P$41 v27,9.1 | 11.5,18.5 v11.6,18.6 | v11.5,21.6 R10.1 12.2,19.2 v11.6,18.6 | J1.P$6 11.45,18.75 v11.6,18.6
  Route15 0.178: v11.6,18.6 11.6,12.9 17.9,6.6 25.6,6.6 27,8 v27,9.1
  Bottom 0.178: TP5.TP 11,22.1 v11.5,21.6
!WP
  Top 0.178: R11.1 13,25.3 13.6,24.7 14.1,24.2 15.96,24.2 IC1.3
+3V3  (via drill 0.25, 0.25 pad 0.46)
  Top 0.178: U1.P$25 U1.P$26 21.9,12.6 22.5,12 U1.P$32 | C17.1 C18.1 30.5,10.5 | C9.1 C8.1 C16.1 30.5,10.5 | U1.P$38 25.5,9.7 25.4,9.6 25.4,9.4 25.4,8.4 C15.1 C14.1 C13.1 27.4,8.4 27.7,8.7 v27.7,9.1 27.7,9.5 27.5,9.7 U1.P$42 27.5,11 27.9,11 28.1,11.2 | U1.P$20 20.9,15.6 21,15.5 21,13.5 20.6,13.1 20.4,13.1 | 20.4,13.1 U1.P$25 | U1.P$25 19.3,13.1 19.2,13.2 C10.1 C11.1 C12.1 | 28.1,11.2 28.1,11.6 U1.P$43 | C12.1 18.4,10.6 18.3,10.5 17.9,10.5 17.7,10.3 R1.1 17,10 C19.1 | U1.P$55 28.8,17.6 v29.2,18 | C29.P$1 36.75,20.4 36.75,19.65 v36.5,19.4 36.4,19.3 U3.P$22 | L3.P$2 v35.7,9.5 | C12.1 v19.2,11.2 | R8.P$1 v36.2,22.8 | 28.1,11.2 28.3,11.2 29,10.5 30.5,10.5 | R12.2 22.5,27.1 22,26.6 21.2,26.6 | 21.2,26.6 21.1,26.7 21.1,27.6 20.6,28.1 v14.1,28.1 13.5,28.1 13,27.6 R11.2 12.2,26.3 v12.2,25.9 | 21.2,26.6 IC1.8 | v12.5,21.6 13.1,21.6 13.2,21.5 R10.2 | U1.P$25 20.4,13.1 | 6.22,10.5 5.96,10.75 J1.P$37 J1.P$39
  Top 0.61: v3.1,8.4 v3.1,9.1 3.1,9.5 3.9,10.3 4.09,10.5 6.22,10.5
  Top 0.711: v10.5,3 15.41,3 16.6,4.19 U4.1
  Top 1.016: v10.5,3.7 v10.5,3 10.5,2.9 v10.5,2.2
  Route15 0.178: v12.5,21.6 12.2,21.9 v12.2,25.9
  Bottom 0.178: v3.1,9.1 v3.1,8.4
  pour Route15 (no thermals): 44,0 44,30 0,30 0,0
ANT1
  Top 0.333: 40.9,13.7 L4.P$1 | C25.P$1 40.9,14.7
  Top 0.381: L4.P$1 40.9,14.7 40.4,15.2 38.6,15.2 U3.P$15
ANT2
  Top 0.312: 38.65,16.6 38.62,16.6 U3.P$17
  Top 0.381: 38.65,16.6 40.4,16.6 40.9,17.1 | C26.P$1 40.9,17.1 | 40.9,17.1 L5.P$2
ANT_A  (via drill 0.25)
  Top 0.178: R9.P$2 38.2,22.1 v38.2,23.1 | U1.P$44 28.9,12.1 v29.2,12.4
  Route15 0.178: v29.2,12.4 26,12.4 25.2,13.2 25.2,18 29.1,21.9 38,21.9 38.2,22.1 v38.2,23.1
ANTSEL  (via drill 0.25)
  Top 0.178: 38.2,20.3 38.2,19.7 37.8,19.3 37.8,18.3 37.8,18.14 U3.P$20 | 38.2,20.3 R9.P$1 | 38.2,21.2 R9.P$1 | C28.P$2 38.3,20.4 38.2,20.3 | R2.P$1 34.2,22.7 35,23.5 | 35,23.5 36.5,23.5 37.2,22.8 37.2,22.16 R9.P$1 | v34.9,24.1 34.9,23.6 35,23.5
  Bottom 0.178: TP8.TP 33.6,22.8 v34.9,24.1
C_LNA
  Top 0.178: 36.2,21.1 R8.P$2 | R7.P$1 R8.P$2 | U3.P$23 35.68,19.41 R3.P$2 35.76,19.41 36.2,19.85 R8.P$2
EXTAL32
  Top 0.178: 22.5,8.1 22.5,8.4 22.5,8.5 22,9 U1.P$31 | 22.5,8.1 22.5,7.7 | 22.7,7.5 22.6,7.5 X1.P$1 | C3.1 22.6,8.1 22.5,8.1
  Top 0.254: 22.5,7.7 22.7,7.5
EXTAL_32M
  Top 0.178: X2.P$1 27.9,19.3 27.5,18.9 U1.P$1 | C2.1 27.6,22.2 27.7,22.2
  Top 0.254: 27.6,22.2 X2.P$1
  Top 0.406: 27.6,22.2 27.7,22.2
GND  (via drill 0.25, 0.25 pad 0.46)
  Top 0.178: C15.2 C14.2 C13.2 | C8.2 C9.2 | C17.2 C18.2 C16.2 | U1.P$63 27.2,14.85 27.2,15.3 27.5,15.6 U1.P$51 | v26,14.85 U1.P$63 | U1.P$48 28.1,14.1 27.6,14.1 27.2,14.5 27.2,14.8 U1.P$63 | U1.P$65 25.9,14.6 | 26.8,23.6 27.9,23.6 X2.P$4 | 26.8,23.6 26.8,23.7 v26.4,24.1 | C2.2 26.8,23.6 | U3.P$3 34.95,16.62 35.07,16.5 | U3.P$1 v35.1,17.2
  other vias: 37.05,15.25 37.7,15.25 35.1,14.6 35.75,14.6 36.4,14.6 37.05,14.6 37.7,14.6 35.75,17.2 36.4,17.2 37.05,17.2 37.7,17.2 35.1,16.55 35.75,16.55 36.4,16.55 37.05,16.55 37.7,16.55 35.1,15.9 35.75,15.9 36.4,15.9 37.05,15.9 37.7,15.9 35.1,15.25 35.75,15.25 36.4,15.25 32.6,7.8 26.4,6.2 19.2,12.4 35.7,13.2 22.9,14.6 22,14.6 23.9,14.6 22.9,15.5 22.9,13.6 39.1,15.9 39.7,15.9 42.1,16.4 42.1,15.4 41.7,18 41.7,18.8 41.6,20.7 41.6,21.3 41.6,21.9 41.6,22.5 41.6,23.1 41.6,23.7 40,17.7 39.9,13.1 40.1,18.9 40.2,20.7 40.2,21.3 40.2,21.9 40.2,22.5 40.2,23.1 40.2,23.7 42.4,24.4 39.9,12.5 42.5,7 41.9,7 41.6,7.7 41.6,10.1 41.6,9.5 41.6,8.9 41.9,13.7 42,12.9 41.6,10.7 41.6,8.3 41.8,24.4 40,18.3 39.4,24.4 40,24.4 40.1,27.8 38.9,27.8 39.5,27.8 42.9,27.8 42.3,27.8 41.7,27.8 39.9,13.7 40.3,15.9 11.7,20 40.2,10.7 40.2,10.1 40.2,9.5 40.2,8.9 40.2,8.3 40.2,7.7 39.3,7 39.9,7 40.1,3.6 38.9,3.6 39.5,3.6 43,3.6 42.4,3.6 41.8,3.6 35.5,22.9 37,21.3 40.2,20.1 40.2,19.5 40.2,11.3 40.2,11.9 39.9,14.3 41,15.6 41,16.2 41.5,16.4 41.5,15.4 29.3,16.1 13.8,9.69 12.3,10.6 0.7,26.76 0.7,24.22 0.7,21.68 0.7,19.14 0.7,15.33 0.7,5.78 0.7,3.24 0.7,0.7 3.24,0.7 5.78,0.7 8.32,0.7 11.22,0.7 13.76,0.7 16.3,0.7 18.84,0.7 21.38,0.7 23.92,0.7 26.46,0.7 0.7,29.3 3.24,29.3 29,0.7 31.54,0.7 34.08,0.7 36.62,0.7 39.16,0.7 41.7,0.7 5.78,29.3 8.32,29.3 11.22,29.3 13.76,29.3 16.3,29.3 18.84,29.3 21.38,29.3 23.92,29.3 26.46,29.3 29,29.3 31.54,29.3 34.08,29.3 36.62,29.3 39.16,29.3 41.7,29.3
  pour Bottom (no thermals): 44,0 44,30 0,30 0,0
  pour Top (no thermals): 44,0 44,30 0,30 0,0
  pour Route2 (no thermals): 44,0 44,30 0,30 0,0
GPIO1  (via drill 0.25)
  Top 0.178: U1.P$2 27,18.7 27,19.4 27,19.6 27.3,19.9 27.3,20.6 v27.2,20.7 | v14.2,11 13.1,12.1 12.3,12.1 11.9,12.5 11.65,12.75 J1.P$30
  Bottom 0.178: v14.2,11 14.5,10.7 19.8,10.7 20.2,11.1 20.2,16.3 21.1,17.2 24.2,17.2 24.5,17.2 25.6,18.3 25.6,20 26.5,20.9 27,20.9 v27.2,20.7
GPIO2  (via drill 0.25)
  Top 0.177: R3.P$1 35.4,20.3 35.4,20.2
  Top 0.178: v13.5,10.3 11.8,12 11.55,12.25 J1.P$32 | v34.9,20.2 35.4,20.2 35.61,20.2 | U1.P$3 26.5,19.4 26.5,20 v26.7,20.2
  Bottom 0.178: v13.5,10.3 20,10.3 20.7,11 20.7,15.9 21.3,16.5 24.7,16.5 26,17.8 26.5,18.3 26.5,19.3 26.95,19.75 27,19.8 27.05,19.85 | 27.05,19.85 27.4,20.2 v34.9,20.2 | v26.7,20.2 27.05,19.85
PTA0/JTAG_TCLK/SWD_CLK/EZP_CLK/!UART0_CTS/!UART0_COL/FTM0_CH5  (via drill 0.25)
  Top 0.178: v17.3,19.6 13.6,19.6 12.1,18.1 11.4,18.1 11.25,18.25 J1.P$8 | U1.P$33 23,10.5 v22.5,10
  Route15 0.178: v22.5,10 19.1,10 17.3,11.8 v17.3,19.6
  Bottom 0.178: 17.3,20.9 v17.3,19.6
  Bottom 0.406: 17.3,20.9 17.1,20.9 TP4.TP
PTA1/JTAG_TDI/EZP_DI/UART0/RX/FTM0_CH6  (via drill 0.25)
  Top 0.178: v16.5,19.1 13.7,19.1 12.5,17.9 12.35,17.75 J1.P$10 8.05,17.75 7.7,18.1 7.7,20.1 8,20.4 v11,20.4 | v22.7,9.1 22.7,9.2 23,9.5 23,10 23.5,10.5 U1.P$34
  Route15 0.178: v22.7,9.1 22.2,9.1 21.8,9.5 19,9.5 16.9,11.6 16.9,18.7 v16.5,19.1
  Bottom 0.178: TP3.TP 8.6,22.9 8.8,22.9 11,20.7 v11,20.4
PTA2/JTAG_TDO/TRACE?SWO/EZP_DO/UART0_TX/FTM0_CH7  (via drill 0.25)
  Top 0.178: v23.6,9.8 23.6,10.1 24,10.5 U1.P$35 | v15.8,18.6 13.8,18.6 12.55,17.35 12.45,17.25 J1.P$12
  Route15 0.178: v15.8,18.6 16.5,17.9 16.5,11.4 19.1,8.8 21.7,8.8 21.9,8.6 23.1,8.6 23.6,9.1 v23.6,9.8
  Bottom 0.178: TP2.TP 16,16.4 15.9,16.5 15.9,18.5 v15.8,18.6
PTA3/JTAG_TMS/SWD_DIO/UART0_RTS/FTM0_CH0  (via drill 0.25)
  Top 0.178: v15.1,18 13.8,18 12.65,16.85 12.55,16.75 J1.P$14 | U1.P$36 24.5,10.5 24.3,10.3 v24.3,9 24.3,9.1
  Route15 0.178: v15.1,18 15.4,18 16.1,17.3 16.1,11.2 19.1,8.2 23.5,8.2 v24.3,9
  Bottom 0.178: TP1.TP 24.5,8.8 v24.3,9
PTA4/LLWU_P3/!NMI!/!EZP_CS!/FTM0_CH1  (via drill 0.25)
  Top 0.178: v15.1,17.1 13.5,17.1 12.75,16.35 12.65,16.25 J1.P$16 | U1.P$37 25,10.1 v25,9.9
  Route15 0.178: v15.1,17.1 15.4,17.1 15.7,16.8 15.7,11.1 19,7.8 24.6,7.8 25,8.2 25,9.5 v25,9.9
PTA18/EXTAL0/FTM0_FTL2_FTM_CLKIN0  (via drill 0.25)
  Top 0.178: v14.6,16.3 13.3,16.3 12.85,15.85 12.75,15.75 J1.P$18 | U1.P$39 26,10.6 25.9,10.5 25.9,10.4 v25.9,9.1
  Route15 0.178: v14.6,16.3 15.2,16.3 15.3,16.2 15.3,10.8 18.7,7.4 24.9,7.4 25.9,8.4 v25.9,9.1
PTA19/XTAL0/FTM1_FLT0/FTM_CLKIN1/LPTMR0_ALT1  (via drill 0.25)
  Top 0.178: v14.6,15.7 13.4,15.7 13.1,15.4 12.95,15.25 J1.P$20 | U1.P$40 26.5,10.6 26.4,10.5 v26.4,10
  Route15 0.178: v26.4,10 26.4,8.1 25.3,7 18.3,7 14.7,10.6 14.7,15.6 v14.6,15.7
PTC4/LLWU_P8/SPI0_PCS0/UART1_TX/FTM0_CH3/CMP1_OUT  (via drill 0.25)
  Top 0.178: U1.P$4 v26,21.2 | J1.P$22 11.95,14.75 v12.2,14.5
  Route15 0.178: v26,21.2 26,22.5 26.4,22.9 27.1,22.9 27.3,23.1 27.3,24.6 26.8,25.1 25.8,25.1 25,25.9 15.2,25.9 14.6,26.5 13.7,26.5 13.4,26.2 13.4,21.1 12.2,19.9 v12.2,14.5
  Bottom 0.178: v12.2,14.5 11.6,15.1 TP13.TP
PTC5/LLWU_P9/SPI0_SCK/LPTMR0_ALT2/I2S0_RXDO/CMP0_OUT  (via drill 0.25)
  Top 0.178: 12.5,14 v12.8,13.7 12.5,14 | U1.P$5 25.5,21 23.8,22.7 v23.8,24.1 23.7,24.2 21.9,24.2 21.23,24.2 IC1.6 | J1.P$24 11.65,14.25 11.9,14 12.5,14
  Route15 0.178: v12.8,13.7 12.8,19.7 16.1,23 22.7,23 v23.8,24.1
  Bottom 0.178: v12.8,13.7 12.5,13.4 10.2,13.4 8.7,13.4 TP14.TP
PTC6/LLWU_P10/CMP0_IN0/SPI0_SOUT/PDB0_EXTRG/I2S0_RX_BCLK/I2S0_MCLK  (via drill 0.25)
  Top 0.178: v13.5,14.5 13.5,13.3 13.3,13.1 12.6,13.1 12.2,13.5 11.6,13.5 11.35,13.75 J1.P$26 | U1.P$6 25,20.7 v23.7,22 22.8,22.9 22,22.9 IC1.5
  Route15 0.178: v13.5,14.5 13.5,18.7 16.8,22 v23.7,22
PTC7/CMP0_IN1/SPI0_SIN/USB_SOF_OUT/I2S0_RX_FS  (via drill 0.25)
  Top 0.178: v14.1,13.8 14.1,13.3 13.5,12.7 12.3,12.7 12,13 11.9,13.1 11.5,13.1 11.35,13.25 J1.P$28 | v21.3,21.4 23.6,21.4 24.5,20.5 U1.P$7 | v14.1,25.9 14.6,25.4 15.96,25.4 IC1.2
  Route15 0.178: v14.1,13.8 14.1,18.5 16.7,21.1 21.1,21.1 21.3,21.3 v21.3,21.4 22.2,21.4 22.4,21.2 24.4,21.2 25,21.8 25,24.2 24.3,24.9 16.4,24.9 16,25.3 14.4,25.3 14.1,25.6 v14.1,25.9
PTD1/ADC0_SE5B/SPI0_SCK/!UART2_CTS
  Top 0.178: U1.P$8 24,20.3 23.4,20.9 22,20.9 21.9,20.8 19,20.8 18.7,20.5 16.1,20.5 15.1,21.5 14.4,21.5 13,22.9 13,23.5 12.7,23.8 12.3,23.8 6.1,23.8 3.2,20.9 3.2,19 3.45,18.75 J1.P$5
PTD2/LLWU_P13/SPI0_SOUT/UART2_RX/I2C0_SDA/GPIO4_BSM_DATA  (via drill 0.25)
  Top 0.178: U1.P$9 23.5,19.8 v23.4,19.9 | J1.P$7 2.25,18.25 v2,18
  Route2 0.178: v23.4,19.9 24.9,19.9 25.5,20.5 25.5,24.6 24.7,25.4 9.8,25.4 8.7,24.3 7.6,24.3 6.6,24.3 2.1,19.8 2,19.7 2,18.7 v2,18
PTD3/SPI0_SIN/UART2_TX/I2C0_SCL/GPIO5_BSM_CLK  (via drill 0.25)
  Top 0.178: U1.P$10 23,19.4 22.8,19.6 v22.8,20.2 | v22.8,20.2 22.8,20.3 v22.8,20.2 | J1.P$9 2.85,17.75 v2.6,17.5
  Route2 0.178: v22.8,20.2 23.1,20.5 24.8,20.5 25.1,20.8 25.1,24.3 24.4,25 10,25 8.8,23.8 7.8,23.8 6.7,23.8 2.9,20 2.6,19.7 2.6,19.4 2.6,18.6 v2.6,17.5
PTD4/LLWU_P14/MADC0_SE21/SPI0_PCS1/!UART0_RTS!/FTM0_CH4/EWM_IN/GPIO_BSM_FRAME  (via drill 0.25)
  Top 0.178: U1.P$11 22.5,19.5 v22.2,19.8 | J1.P$11 3.25,17.25 3,17 v2,17
  Route2 0.178: v22.2,19.8 22.2,20.7 22.5,21 24.5,21 24.7,21.2 24.7,24.2 24.3,24.6 11.3,24.6 10.2,24.6 8.4,22.8 7.8,22.8 v7.6,22.6 7.5,22.7 6.3,22.7 3.6,20 3.6,17.7 2.9,17 v2,17
  Bottom 0.178: v7.6,22.6 TP9.TP
PTD5/ADC0_SE6B/SPI0_PCS2/!UART0_CTS!/!UART0_COL!/FTM0_CH5/!EWM_OUT  (via drill 0.25)
  Top 0.178: v21.6,20.2 21.6,19.5 22,19.1 U1.P$12 | v14.1,27.2 14.6,26.7 IC1.1 | J1.P$13 3.35,16.75 3.1,16.5 v2.6,16.5
  Route2 0.178: v21.6,20.2 21.6,20.8 22.2,21.4 24,21.4 24.3,21.7 24.3,23.1 24,23.4 23.3,23.4 22.5,24.2 11.6,24.2 10.5,24.2 10.3,24 7.2,20.9 7.2,19.9 3.8,16.5 v2.6,16.5
  Route15 0.178: v2.6,16.5 7.1,16.5 9.9,19.3 v9.9,25.9 10.7,26.7 12.3,26.7 12.8,27.2 v14.1,27.2
  Bottom 0.178: v9.9,25.9 9.9,28.3 10.1,28.3 TP10.TP
PTD6/LLWU_P15/ADC0_SE7B/SPI0_PCS3/UART0_RX/FTM0_CH6/FTM0_FLT0  (via drill 0.25)
  Top 0.178: v21,19.9 21,19.6 21.5,19.1 U1.P$13 | J1.P$15 3.35,16.25 3.1,16 v2,16
  Route2 0.178: v21,19.9 21,20.7 20.7,21 20.7,23.2 20.1,23.8 11.8,23.8 10.7,23.8 10.4,23.5 7.6,20.7 7.6,19.8 3.8,16 v2,16
  Route15 0.178: v11.1,25.9 11.1,25.1 10.5,24.5 10.5,19.2 7.3,16 v2,16
  Bottom 0.178: TP11.TP 11.3,26.1 v11.1,25.9
PTD7/MADC0_SE22/CMT_IRO/UART0_TX/FTM0_CH7/FTM0_FLT1  (via drill 0.25)
  Top 0.178: v20.2,20.2 20.2,19.7 21,18.9 U1.P$14 | J1.P$17 3.45,15.75 3.2,15.5 v2.6,15.5
  Route2 0.178: v20.2,20.2 20.2,22.9 19.7,23.4 12.3,23.4 10.9,23.4 10.8,23.3 8,20.5 8,19.7 3.8,15.5 v2.6,15.5
  Bottom 0.178: TP12.TP 2,19.4 1.2,18.6 1.2,15.9 1.6,15.5 v2.6,15.5
PTE0/MADC0_SE10/SPI1_PCS1/UART1_TX/MTRACE_CLKOUT/I2C1_SDA/RTC_CLKOUT  (via drill 0.25)
  Top 0.178: v19.2,20 20.4,18.8 20.4,18.1 U1.P$15 | J1.P$19 3.45,15.25 3.2,15 v2,15
  Route2 0.178: v19.2,20 19.2,22.7 18.9,23 12.3,23 11.1,23 10.9,22.8 8.4,20.3 8.4,19.6 3.8,15 v2,15
  Bottom 0.178: v2,15 1.7,15 0.7,14 0.7,6.8 TP15.TP
PTE1/LLWU_P0/MADC0_SE11/SPI1_SOUT/UART1_RX/MTRACE_D3/I2C1_SCL/SPI1_SIN  (via drill 0.25)
  Top 0.178: v18.3,19.6 18.7,19.6 19.6,18.7 19.6,17.9 19.9,17.6 U1.P$16 | J1.P$21 3.55,14.75 3.3,14.5 v2.6,14.5
  Route2 0.178: v18.3,19.6 18.3,22 17.7,22.6 12.22,22.6 11.3,22.6 11.2,22.5 8.8,20.1 8.8,19.5 3.8,14.5 v2.6,14.5
  Bottom 0.178: v2.6,14.5 2.9,14.5 4.3,13.1 4.3,3.8 TP16.TP
PTE2/LLWU_P1/MADC0_DP1/SPI1_SCK/!UART1_CTS!/MTRACE_D2  (via drill 0.25)
  Top 0.178: v18,18.9 18.7,18.9 19.2,18.4 19.2,17.8 19.9,17.1 U1.P$17 | J1.P$23 3.65,14.25 3.4,14 v2,14
  Route2 0.178: v18,18.9 17.8,19.1 17.8,21.9 17.5,22.2 11.4,22.2 9.2,20 9.2,19.4 3.8,14 v2,14
  Bottom 0.178: v2,14 1.2,13.2 1.2,8.5 2,7.7 TP17.TP
PTE3/MADC0_DM1/SPI1_SIN/!UART1_RTS!/MTRACE_D1/SPI1_SOUT  (via drill 0.25)
  Top 0.178: U1.P$18 19.8,16.6 18.6,17.8 v18.6,18.1 | J1.P$25 3.65,13.75 3.4,13.5 v2.6,13.5
  Route2 0.178: v2.6,13.5 3.8,13.5 5.4,15.1 13.8,15.1 14,14.9 14.7,14.9 17.9,18.1 v18.6,18.1
  Bottom 0.178: v2.6,13.5 3,13.5 3.8,12.7 3.8,5.3 TP18.TP
PTE4/LLWU_P2/SPI1_PCS0/MTRACE_D0  (via drill 0.25)
  Top 0.178: v18.3,17.3 19.5,16.1 U1.P$19 | J1.P$27 3.65,13.25 3.4,13 v2,13
  Route2 0.178: v18.3,17.3 17.7,17.3 14.7,14.3 14.7,13.6 14.2,13.1 3.6,13.1 3.5,13 v2,13
PTE16/ADC0_SE4A/SPI0_PCS0/UART2_TX/FTM_CLKIN0/FTM0_FLT3  (via drill 0.25)
  Top 0.178: v18.4,16.4 19.7,15.1 U1.P$21 | J1.P$29 3.65,12.75 3.4,12.5 v2.6,12.5
  Route2 0.178: v18.4,16.4 17.3,16.4 15.1,14.2 15.1,13.5 14.3,12.7 3.8,12.7 3.6,12.5 v2.6,12.5
PTE17/ADC0_SE5A/SPI0_SCK/UART2_RX/FTM_CLKIN1/LPTMR0_ALT3  (via drill 0.25)
  Top 0.178: v18.4,15.7 19.5,14.6 U1.P$22 | J1.P$31 3.65,12.25 3.4,12 v2,12
  Route2 0.178: v18.4,15.7 17.1,15.7 15.5,14.1 15.5,13.3 14.5,12.3 4,12.3 3.7,12 v2,12
PTE18/ADC0_SE6A/SPI0_SOUT/!UART2_CTS!/I2C0_SDA  (via drill 0.25)
  Top 0.178: v18.3,14.9 18.4,14.9 19.2,14.1 U1.P$23 | J1.P$33 3.75,11.75 3.5,11.5 v2.6,11.5
  Route2 0.178: v18.3,14.9 16.8,14.9 15.9,14 15.9,13.2 14.6,11.9 4.4,11.9 4,11.5 v2.6,11.5
PTE19/ADC0_SE7A/SPI0_SIN/!UART2_RTS!/I2C0_SCL  (via drill 0.25)
  Top 0.178: v18.2,14 18.6,14 19,13.6 U1.P$24 | J1.P$35 3.75,11.25 3.5,11 v2,11
  Route2 0.178: v18.2,14 16.6,14 16.3,13.7 16.3,13 14.8,11.5 4.5,11.5 4,11 v2,11
RADIO_AREG  (via drill 0.25)
  Top 0.178: 33.4,17.5 34.05,17.5 34.05,17.49 U3.P$2 | R6.P$1 33.4,17.5 | 33.4,17.5 32.5,17.5 | 32.5,17.5 C21.P$1 | 32.5,17.5 32.4,17.4 v32.4,16.6 | 30.2,17.2 C5.1 30.2,18.4 30.5,18.7 31.6,18.7 31.9,18.4 31.9,17.6 32,17.5 32.5,17.5 | 30.2,17.2 C6.1 | C6.1 30.2,16.9 | 30.2,16.9 C7.1 | U1.P$52 U1.P$53 U1.P$54 v29.4,17.1 C6.1 | C6.1 30.1,17.2 | 30.1,17.2 C6.1 | C6.1 30.2,16.9 | 30.2,16.9 C6.1 | C6.1 30.2,17.2 | 30.2,17.2 30.1,17.2 | 30.1,17.2 30.2,17.2
  Bottom 0.178: TP7.TP 31,11.9 29.8,13.1 29.2,13.1 28.9,13.1 28.5,13.5 28.5,14.7 29.1,15.3 29.7,15.3 30,15.6 30,16.7 29.6,17.1 v29.4,17.1
RF_OUTN
  Top 0.178: 28.1,15.1 U1.P$50
  Top 0.254: U1.P$50 28.16,15.06 29.09,15.06 30.17,15.06 L1.P$1
RF_OUTP
  Top 0.178: 28.1,14.6 U1.P$49
  Top 0.254: U1.P$49 28.16,14.63 29.11,14.63 30.17,14.63 L2.P$1
RFN
  Top 0.254: R4.P$2 33.13,15.06 33.54,15.06 34.08,15.06 U3.P$5
RFN_MATCH
  Top 0.254: L1.P$2 30.83,15.06 31.37,15.06 31.82,15.06 C20.P$2 31.9,15.06 31.96,15.06 32.51,15.06 R4.P$1
RFP
  Top 0.2: U3.P$6
  Top 0.254: R5.P$2 33.09,14.63 33.67,14.63 34.03,14.63 U3.P$6
RFP_MATCH
  Top 0.254: L2.P$2 30.83,14.63 31.02,14.63 31.83,14.63 C20.P$1 31.9,14.63 31.97,14.63 32.51,14.63 R5.P$1
TAMPER/!RTC_WAKEUP
  Top 0.178: R1.2 19.8,10 19.9,10 20,10 21,11 U1.P$29
TX_SWITCH  (via drill 0.25)
  Top 0.178: 34.5,19 34.75,18.75 35,18.5 35,18.15 35,18.14 U3.P$24 | 34.5,19 33.8,19 33.3,19.5 33.3,19.7 | U1.P$47 28.4,13.6 28.6,13.8 v29.2,13.8 | v32.4,19.7 33.3,19.7 | 33.3,19.7 C30.P$2 | R2.P$2 34.2,19.3 34.5,19
  Route15 0.178: v29.2,13.8 27.7,13.8 27.2,14.3 27.2,17.7 29.2,19.7 v32.4,19.7
  Bottom 0.178: v29.2,13.8 30.9,13.8 33.2,11.5 TP6.TP
U.FL.ANT1
  Top 0.312: 40.9,11.7 C24.P$1 | A1.3 40.9,6.7
  Top 0.381: L4.P$2 40.9,11.7 A1.3
U.FL.ANT2
  Top 0.312: 40.9,19.6 41,19.6 | 40.9,19.7 C27.P$1 40.96,19.6
  Top 0.381: L5.P$1 40.9,19.6 40.96,19.6 | 40.9,19.7 40.9,23.5 A2.3
VCC_DIG_PA
  Top 0.178: U3.P$10 C23.P$1 | C22.P$2 | C22.P$2 35,13.65 35,13.66 U3.P$8 | C22.P$2 35.7,12.5 | 35.7,12.5 C23.P$1 | C23.P$1 | L3.P$1 35.7,12.5
VIN
  Top 0.178: J1.P$40 J1.P$38 9.12,10.75 8.89,10.52
  Top 0.711: 8.89,10.52 11.19,10.52 11.5,10.2 11.9,9.8 12.89,8.81 U4.3
XTAL32
  Top 0.178: 20.1,7.5 20.1,8.5 20.3,8.7 21.1,8.7 21.5,9.1 U1.P$30 | C4.1 19.6,7 20.1,7.5 | 20.1,7.5 X1.P$2
XTAL_32M
  Top 0.178: 30.6,23.2 C1.1 32.2,23.2 32.4,23 32.4,20.8 31.8,20.2 29.8,20.2 28.1,18.5 28.1,18.1 U1.P$56
  Top 0.254: 30.6,23.2 30.3,23.5 X2.P$3

### Text on the board
bPlace: KW2CPU.v1.3 | 8/11/15